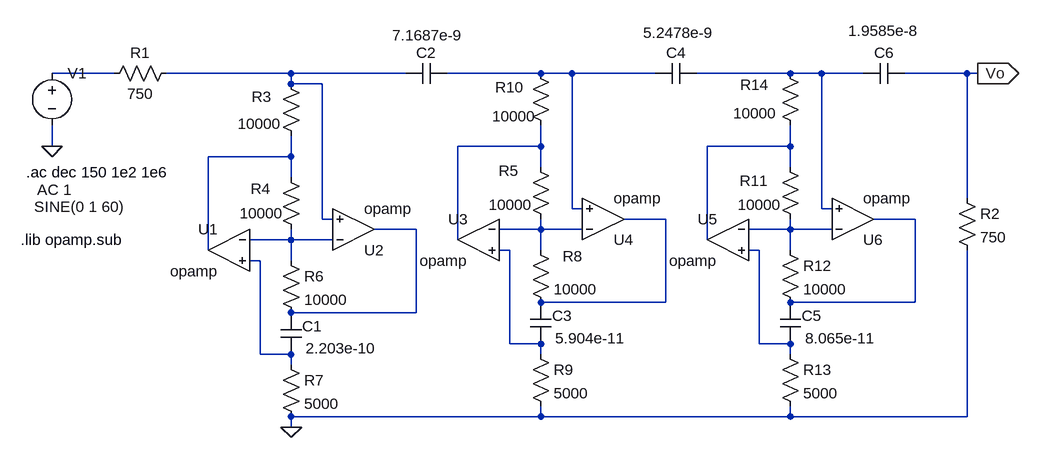
[diagram p0: schematic PassaAltasRCAtivo.asc]
PassaAltasRCAtivo.asc, the LTspice schematic file:
Version 4
SHEET 1 1832 760
WIRE 192 64 96 64
WIRE 464 64 272 64
WIRE 640 64 464 64
WIRE 848 64 704 64
WIRE 896 64 848 64
WIRE 1024 64 896 64
WIRE 1232 64 1088 64
WIRE 1280 64 1232 64
WIRE 1344 64 1280 64
WIRE 1504 64 1408 64
WIRE 1520 64 1504 64
WIRE 464 80 464 64
WIRE 512 80 464 80
WIRE 96 176 96 144
WIRE 848 176 848 144
WIRE 848 176 720 176
WIRE 1232 176 1232 144
WIRE 1232 176 1104 176
WIRE 464 192 464 160
WIRE 464 192 336 192
WIRE 848 208 848 176
WIRE 1232 208 1232 176
WIRE 464 224 464 192
WIRE 1504 256 1504 64
WIRE 896 272 896 64
WIRE 912 272 896 272
WIRE 1280 272 1280 64
WIRE 1296 272 1280 272
WIRE 512 288 512 80
WIRE 528 288 512 288
WIRE 1040 288 976 288
WIRE 1424 288 1360 288
WIRE 656 304 592 304
WIRE 848 304 848 288
WIRE 848 304 784 304
WIRE 912 304 848 304
WIRE 1232 304 1232 288
WIRE 1232 304 1168 304
WIRE 1296 304 1232 304
WIRE 464 320 464 304
WIRE 464 320 400 320
WIRE 528 320 464 320
WIRE 720 320 720 176
WIRE 1104 320 1104 176
WIRE 336 336 336 192
WIRE 800 336 784 336
WIRE 848 336 848 304
WIRE 1184 336 1168 336
WIRE 1232 336 1232 304
WIRE 416 352 400 352
WIRE 464 352 464 320
WIRE 1040 416 1040 288
WIRE 1040 416 848 416
WIRE 1424 416 1424 288
WIRE 1424 416 1232 416
WIRE 656 432 656 304
WIRE 656 432 464 432
WIRE 800 480 800 336
WIRE 848 480 800 480
WIRE 1184 480 1184 336
WIRE 1232 480 1184 480
WIRE 416 496 416 352
WIRE 464 496 416 496
WIRE 848 496 848 480
WIRE 1232 496 1232 480
WIRE 464 512 464 496
WIRE 848 592 848 576
WIRE 848 592 464 592
WIRE 1232 592 1232 576
WIRE 1232 592 848 592
WIRE 1504 592 1504 336
WIRE 1504 592 1232 592
WIRE 464 608 464 592
FLAG 1520 64 Vo
IOPIN 1520 64 Out
FLAG 464 608 0
FLAG 96 176 0
SYMBOL voltage 96 48 R0
WINDOW 123 -23 195 Left 2
WINDOW 39 0 0 Left 0
WINDOW 3 -27 221 Left 2
SYMATTR Value2 AC 1
SYMATTR Value SINE(0 1 60)
SYMATTR InstName V1
SYMBOL res 288 48 R90
WINDOW 0 0 56 VBottom 2
WINDOW 3 32 56 VTop 2
SYMATTR InstName R1
SYMATTR Value 750
SYMBOL res 1488 240 R0
SYMATTR InstName R2
SYMATTR Value 750
SYMBOL cap 704 48 R90
WINDOW 0 0 32 VBottom 2
WINDOW 3 -58 30 VTop 2
SYMATTR InstName C2
SYMATTR Value 7.1687e-9
SYMBOL cap 1088 48 R90
WINDOW 0 0 32 VBottom 2
WINDOW 3 -62 28 VTop 2
SYMATTR InstName C4
SYMATTR Value 5.2478e-9
SYMBOL cap 1408 48 R90
WINDOW 0 0 32 VBottom 2
WINDOW 3 -65 32 VTop 2
SYMATTR InstName C6
SYMATTR Value 1.9585e-8
SYMBOL Opamps\\opamp 368 272 M0
SYMATTR InstName U1
SYMATTR SpiceLine Aol=100G
SYMATTR SpiceLine2 GBW=100G
SYMBOL res 448 64 R0
WINDOW 0 -45 36 Left 2
WINDOW 3 -66 77 Left 2
SYMATTR InstName R3
SYMATTR Value 10000
SYMBOL res 448 208 R0
WINDOW 0 -46 33 Left 2
WINDOW 3 -63 71 Left 2
SYMATTR InstName R4
SYMATTR Value 10000
SYMBOL res 448 336 R0
SYMATTR InstName R6
SYMATTR Value 10000
SYMBOL res 448 496 R0
SYMATTR InstName R7
SYMATTR Value 5000
SYMBOL cap 480 496 R180
WINDOW 0 -32 43 Left 2
WINDOW 3 -116 9 Left 2
SYMATTR InstName C1
SYMATTR Value 2.203e-10
SYMBOL Opamps\\opamp 560 368 M180
SYMATTR InstName U2
SYMATTR SpiceLine Aol=100G
SYMATTR SpiceLine2 GBW=100G
SYMBOL Opamps\\opamp 752 256 M0
SYMATTR InstName U3
SYMATTR SpiceLine Aol=100G
SYMATTR SpiceLine2 GBW=100G
SYMBOL res 832 192 R0
WINDOW 0 -49 22 Left 2
WINDOW 3 -64 74 Left 2
SYMATTR InstName R5
SYMATTR Value 10000
SYMBOL res 832 320 R0
WINDOW 0 50 25 Left 2
SYMATTR InstName R8
SYMATTR Value 10000
SYMBOL res 832 480 R0
SYMATTR InstName R9
SYMATTR Value 5000
SYMBOL cap 864 480 R180
WINDOW 0 -32 43 Left 2
WINDOW 3 -116 9 Left 2
SYMATTR InstName C3
SYMATTR Value 5.904e-11
SYMBOL Opamps\\opamp 944 352 M180
SYMATTR InstName U4
SYMATTR SpiceLine Aol=100G
SYMATTR SpiceLine2 GBW=100G
SYMBOL res 832 48 R0
WINDOW 0 -54 37 Left 2
WINDOW 3 -59 82 Left 2
SYMATTR InstName R10
SYMATTR Value 10000
SYMBOL Opamps\\opamp 1136 256 M0
SYMATTR InstName U5
SYMATTR SpiceLine Aol=100G
SYMATTR SpiceLine2 GBW=100G
SYMBOL res 1216 192 R0
WINDOW 0 -62 37 Left 2
WINDOW 3 -65 74 Left 2
SYMATTR InstName R11
SYMATTR Value 10000
SYMBOL res 1216 320 R0
SYMATTR InstName R12
SYMATTR Value 10000
SYMBOL res 1216 480 R0
SYMATTR InstName R13
SYMATTR Value 5000
SYMBOL cap 1248 480 R180
WINDOW 0 -32 43 Left 2
WINDOW 3 -116 9 Left 2
SYMATTR InstName C5
SYMATTR Value 8.065e-11
SYMBOL Opamps\\opamp 1328 352 M180
SYMATTR InstName U6
SYMATTR SpiceLine Aol=100G
SYMATTR SpiceLine2 GBW=100G
SYMBOL res 1216 48 R0
WINDOW 0 -61 33 Left 2
WINDOW 3 -72 77 Left 2
SYMATTR InstName R14
SYMATTR Value 10000
TEXT 56 216 Left 2 !.ac dec 150 1e2 1e6
TEXT 48 320 Left 2 !.lib opamp.sub

The netlist it stands for:
* PassaAltasRCAtivo.asc
V1 N001 0 SINE(0 1 60) AC 1
R1 N002 N001 750
R2 Vo 0 750
C2 N003 N002 7.1687e-9
C4 N004 N003 5.2478e-9
C6 Vo N004 1.9585e-8
XU1 N013 N016 N007 opamp Aol=100G GBW=100G  ; pins invin noninvin out
R3 N002 N007 10000
R4 N007 N013 10000
R6 N013 N010 10000
R7 N016 0 5000
C1 N016 N010 2.203e-10
XU2 N013 N002 N010 opamp Aol=100G GBW=100G  ; pins invin noninvin out
XU3 N011 N014 N005 opamp Aol=100G GBW=100G  ; pins invin noninvin out
R5 N005 N011 10000
R8 N011 N008 10000
R9 N014 0 5000
C3 N014 N008 5.904e-11
XU4 N011 N003 N008 opamp Aol=100G GBW=100G  ; pins invin noninvin out
R10 N003 N005 10000
XU5 N012 N015 N006 opamp Aol=100G GBW=100G  ; pins invin noninvin out
R11 N006 N012 10000
R12 N012 N009 10000
R13 N015 0 5000
C5 N015 N009 8.065e-11
XU6 N012 N004 N009 opamp Aol=100G GBW=100G  ; pins invin noninvin out
R14 N004 N006 10000
.ac dec 150 1e2 1e6
.lib opamp.sub
.backanno
.end